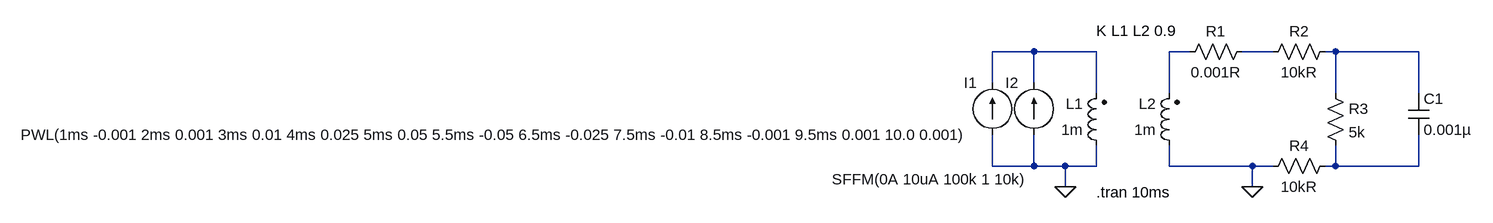
[diagram p0: schematic kb1gtt-VR_inductor_reference_with_noise.asc]
kb1gtt-VR_inductor_reference_with_noise.asc, the LTspice schematic file:
Version 4
SHEET 1 880 680
WIRE 160 64 96 64
WIRE 256 64 160 64
WIRE 400 64 368 64
WIRE 528 64 480 64
WIRE 624 64 608 64
WIRE 752 64 624 64
WIRE 96 112 96 64
WIRE 160 112 160 64
WIRE 256 128 256 64
WIRE 368 128 368 64
WIRE 624 128 624 64
WIRE 752 128 752 64
WIRE 96 240 96 192
WIRE 160 240 160 192
WIRE 160 240 96 240
WIRE 208 240 160 240
WIRE 256 240 256 208
WIRE 256 240 208 240
WIRE 368 240 368 208
WIRE 496 240 368 240
WIRE 528 240 496 240
WIRE 624 240 624 208
WIRE 624 240 608 240
WIRE 752 240 752 192
WIRE 752 240 624 240
WIRE 208 272 208 240
WIRE 496 272 496 240
FLAG 208 272 0
FLAG 496 272 0
SYMBOL ind2 272 224 R180
WINDOW 0 36 80 Left 2
WINDOW 3 36 40 Left 2
SYMATTR InstName L1
SYMATTR Value 1m
SYMATTR Type ind
SYMBOL ind2 384 224 R180
WINDOW 0 36 80 Left 2
WINDOW 3 36 40 Left 2
SYMATTR InstName L2
SYMATTR Value 1m
SYMATTR Type ind
SYMBOL current 96 192 R180
WINDOW 0 24 80 Left 2
WINDOW 3 24 0 Left 2
WINDOW 123 0 0 Left 2
WINDOW 39 0 0 Left 2
SYMATTR InstName I1
SYMATTR Value PWL(1ms -0.001 2ms 0.001 3ms 0.01 4ms 0.025 5ms 0.05 5.5ms -0.05 6.5ms -0.025 7.5ms -0.01 8.5ms -0.001 9.5ms 0.001 10.0 0.001)
SYMBOL res 608 112 R0
SYMATTR InstName R3
SYMATTR Value 5k
SYMBOL cap 736 128 R0
SYMATTR InstName C1
SYMATTR Value 0.001µ
SYMATTR SpiceLine V=50 Irms=55.6m Rser=5.11126 Lser=0 mfg="KEMET" pn="C0603C102K5RAC" type="X7R"
SYMBOL res 496 48 R90
WINDOW 0 0 56 VBottom 2
WINDOW 3 32 56 VTop 2
SYMATTR InstName R1
SYMATTR Value 0.001R
SYMBOL res 624 48 R90
WINDOW 0 0 56 VBottom 2
WINDOW 3 32 56 VTop 2
SYMATTR InstName R2
SYMATTR Value 10kR
SYMBOL res 624 224 R90
WINDOW 0 0 56 VBottom 2
WINDOW 3 32 56 VTop 2
SYMATTR InstName R4
SYMATTR Value 10kR
SYMBOL current 160 192 R180
WINDOW 0 24 80 Left 2
WINDOW 3 11 -68 Left 2
WINDOW 123 0 0 Left 2
WINDOW 39 0 0 Left 2
SYMATTR InstName I2
SYMATTR Value SFFM(0A 10uA 100k 1 10k)
TEXT 256 280 Left 2 !.tran 10ms
TEXT 256 32 Left 2 !K L1 L2 0.9

The netlist it stands for:
* kb1gtt-VR_inductor_reference_with_noise.asc
L1 0 N001 1m
L2 0 N002 1m
I1 0 N001 PWL(1ms -0.001 2ms 0.001 3ms 0.01 4ms 0.025 5ms 0.05 5.5ms -0.05 6.5ms -0.025 7.5ms -0.01 8.5ms -0.001 9.5ms 0.001 10.0 0.001)
R3 N004 N005 5k
C1 N004 N005 0.001µ V=50 Irms=55.6m Rser=5.11126 Lser=0 mfg="KEMET" pn="C0603C102K5RAC" type="X7R"
R1 N003 N002 0.001R
R2 N004 N003 10kR
R4 N005 0 10kR
I2 0 N001 SFFM(0A 10uA 100k 1 10k)
.tran 10ms
K L1 L2 0.9
.backanno
.end